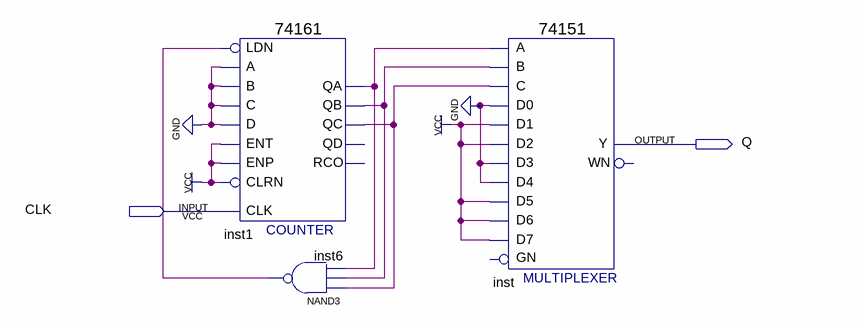
[diagram p0: schematic sheet]
// Quartus schematic lab7.bdf as structural Verilog: 3 symbols, 2 pins
module lab7 (
  input  CLK,
  output Q
);

  wire inst1_qa, inst1_qb, inst1_qc, inst6_out;

  \74161  inst1 (
    .CLRN(1'b1), .CLK(CLK), .ENP(1'b1), .LDN(inst6_out), .A(1'b0), .D(1'b0), .ENT(1'b1), .B(1'b0), .C(1'b0),
    .QC(inst1_qc), .QB(inst1_qb), .QA(inst1_qa));  // open: QD, RCO
  nand inst6 (inst6_out, inst1_qc, inst1_qb, inst1_qa);
  \74151  inst (
    .C(inst1_qc), .B(inst1_qb), .A(inst1_qa), .D5(1'b1), .D0(1'b0), .D1(1'b1), .D4(1'b0), .D3(1'b0),
    .D2(1'b1), .D6(1'b1), .D7(1'b1), .Y(Q));  // open: GN, WN
endmodule
